# Altium schematic sheet FPGAIO.SCHDOC
size B
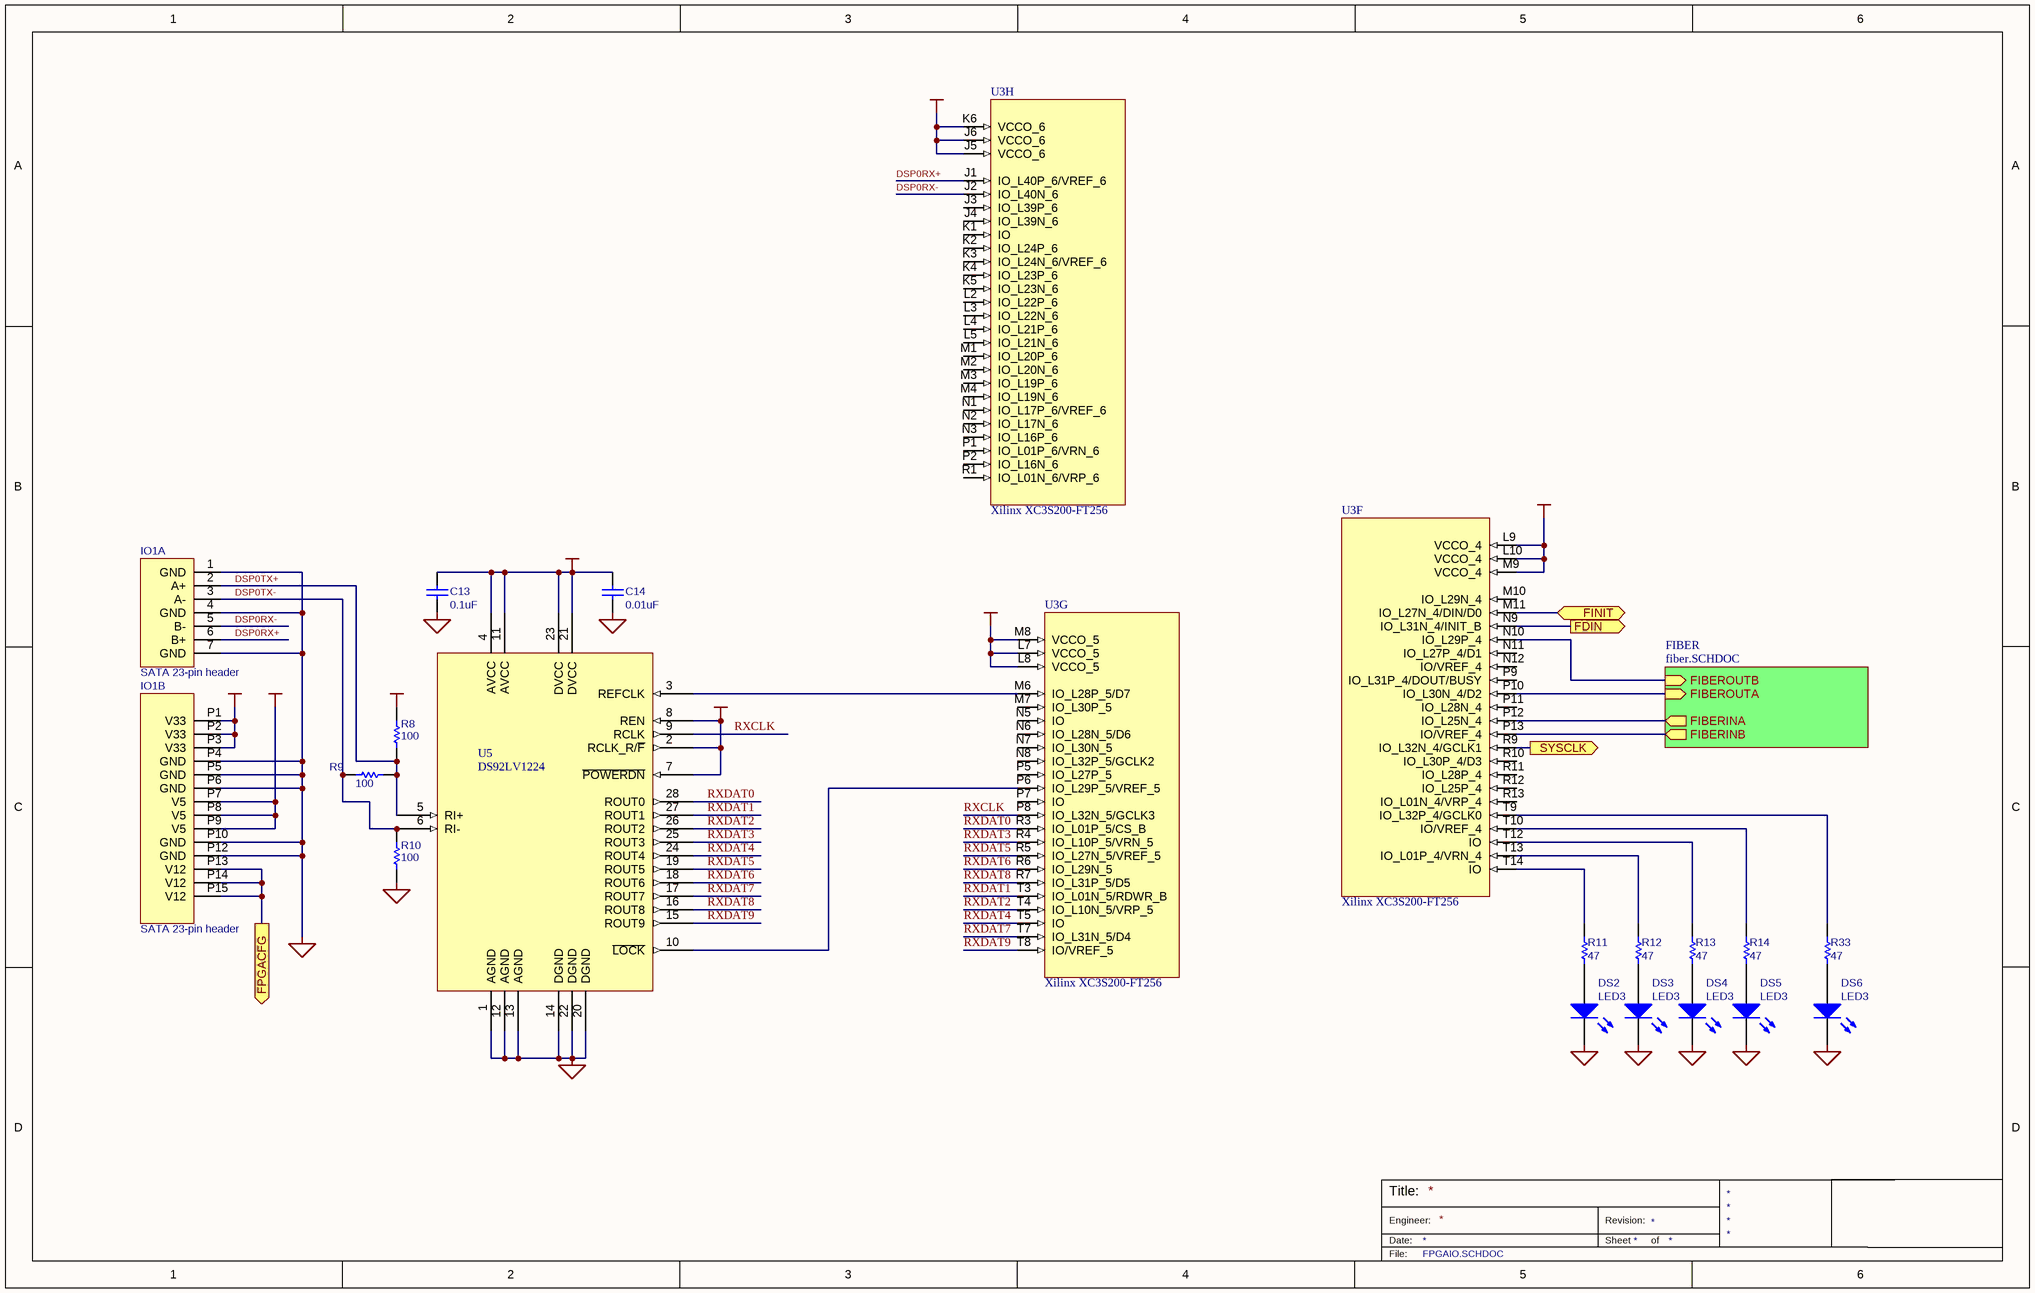
[diagram p0: FPGAIO.SCHDOC]

## Parts
C13  value 0.1uF  [CC1005-0402]  (hidden comment: Cap)
C14  value 0.01uF  [CC1005-0402]  (hidden comment: Cap)
DS2  LED3  [SMD _LED]
DS3  LED3  [SMD _LED]
DS4  LED3  [SMD _LED]
DS5  LED3  [SMD _LED]
DS6  LED3  [SMD _LED]
IO1  SATA 23-pin header  [MOLEX 87703-0001]  (parts A,B of 2)
R8  100  [CR1005-0402]
R9  100  [CR1005-0402]
R10  100  [CR1005-0402]
R11  value 47  [CR1608-0603]  (hidden comment: Res1)
R12  value 47  [CR1608-0603]  (hidden comment: Res1)
R13  value 47  [CR1608-0603]  (hidden comment: Res1)
R14  value 47  [CR1608-0603]  (hidden comment: Res1)
R33  value 47  [CR1608-0603]  (hidden comment: Res1)
U3  Xilinx XC3S200-FT256  [Xilinx FT256 BGA]  (parts F,G,H of 9)
U5  DS92LV1224  [SSO-G28/E4.3]

## Sub-sheets
FIBER = fiber.SCHDOC: FIBERINA (out), FIBEROUTB (in), FIBERINB (out), FIBEROUTA (in)

## Ports
FDIN (out), FINIT (bidir), FPGACFG (out), SYSCLK (out)

## Nets
+2.5VCC: U3.J5(VCCO_6) U3.J6(VCCO_6) U3.K6(VCCO_6)
+5VCC: IO1.P7(V5) IO1.P8(V5) IO1.P9(V5)
GND: C13.1 C14.1 DS2.2(K) DS3.2(K) DS4.2(K) DS5.2(K) DS6.2(K) IO1.1(GND) IO1.4(GND) IO1.7(GND) IO1.P4(GND) IO1.P5(GND) IO1.P6(GND) IO1.P10(GND) IO1.P12(GND) R10.1 U5.1(AGND) U5.12(AGND) U5.13(AGND) U5.14(DGND) U5.20(DGND) U5.22(DGND)
VCC: C13.2 C14.2 IO1.P1(V33) IO1.P2(V33) IO1.P3(V33) R8.1 U3.L7(VCCO_5) U3.L8(VCCO_5) U3.L9(VCCO_4) U3.L10(VCCO_4) U3.M8(VCCO_5) U3.M9(VCCO_4) U5.2(RCLK_R/~{F}) U5.4(AVCC) U5.7(~{POWERDN}) U5.8(REN) U5.11(AVCC) U5.21(DVCC) U5.23(DVCC)
DSP0RX+: IO1.6(B+) U3.J1(IO_L40P_6/VREF_6)
DSP0RX-: IO1.5(B-) U3.J2(IO_L40N_6)
DSP0TX+: IO1.2(A+) R8.2 R9.2 U5.5(RI+)
DSP0TX-: IO1.3(A-) R9.1 R10.2 U5.6(RI-)
FDIN: U3.N9(IO_L31N_4/INIT_B) ; port FDIN
FINIT: U3.M11(IO_L27N_4/DIN/D0) ; port FINIT
FPGACFG: IO1.P13(V12) IO1.P14(V12) IO1.P15(V12) ; port FPGACFG
RXCLK: U3.P8(IO_L32N_5/GCLK3) U5.9(RCLK)
RXDAT0: U3.R3(IO_L01P_5/CS_B) U5.28(ROUT0)
RXDAT1: U3.T3(IO_L01N_5/RDWR_B) U5.27(ROUT1)
RXDAT2: U3.T4(IO_L10N_5/VRP_5) U5.26(ROUT2)
RXDAT3: U3.R4(IO_L10P_5/VRN_5) U5.25(ROUT3)
RXDAT4: U3.T5(IO) U5.24(ROUT4)
RXDAT5: U3.R5(IO_L27N_5/VREF_5) U5.19(ROUT5)
RXDAT6: U3.R6(IO_L29N_5) U5.18(ROUT6)
RXDAT7: U3.T7(IO_L31N_5/D4) U5.17(ROUT7)
RXDAT8: U3.R7(IO_L31P_5/D5) U5.16(ROUT8)
RXDAT9: U3.T8(IO/VREF_5) U5.15(ROUT9)
SYSCLK: U3.R9(IO_L32N_4/GCLK1) ; port SYSCLK
NetDS2_1: DS2.1(A) R11.2
NetDS3_1: DS3.1(A) R12.2
NetDS4_1: DS4.1(A) R13.2
NetDS5_1: DS5.1(A) R14.2
NetDS6_1: DS6.1(A) R33.2
NetR11_1: R11.1 U3.T14(IO)
NetR12_1: R12.1 U3.T13(IO_L01P_4/VRN_4)
NetR13_1: R13.1 U3.T12(IO)
NetR14_1: R14.1 U3.T10(IO/VREF_4)
NetR33_1: R33.1 U3.T9(IO_L32P_4/GCLK0)
NetU3_M6: U3.M6(IO_L28P_5/D7) U5.3(REFCLK)
NetU3_N10: U3.N10(IO_L29P_4) ; sheet FIBER/FIBEROUTB
NetU3_P6: U3.P6(IO_L29P_5/VREF_5) U5.10(~{LOCK})
NetU3_P10: U3.P10(IO_L30N_4/D2) ; sheet FIBER/FIBEROUTA
NetU3_P12: U3.P12(IO_L25N_4) ; sheet FIBER/FIBERINA
NetU3_P13: U3.P13(IO/VREF_4) ; sheet FIBER/FIBERINB

Not connected (* = marked no-connect by the designer): U3 J3(IO_L39P_6) J4(IO_L39N_6) K1(IO) K2(IO_L24P_6) K3(IO_L24N_6/VREF_6) K4(IO_L23P_6) K5(IO_L23N_6) L2(IO_L22P_6) L3(IO_L22N_6) L4(IO_L21P_6) L5(IO_L21N_6) M1(IO_L20P_6) M2(IO_L20N_6) M3(IO_L19P_6) M4(IO_L19N_6) M7(IO_L30P_5) M10(IO_L29N_4) N1(IO_L17P_6/VREF_6) N2(IO_L17N_6) N3(IO_L16P_6) N5(IO) N6(IO_L28N_5/D6) N7(IO_L30N_5) N8(IO_L32P_5/GCLK2) N11(IO_L27P_4/D1) N12(IO/VREF_4) P1(IO_L01P_6/VRN_6) P2(IO_L16N_6) P5(IO_L27P_5) P7(IO) P9(IO_L31P_4/DOUT/BUSY) P11(IO_L28N_4) R1(IO_L01N_6/VRP_6) R10(IO_L30P_4/D3) R11(IO_L28P_4) R12(IO_L25P_4) R13(IO_L01N_4/VRP_4)

## Notes on the sheet
- Title:
- Engineer:
- Date:
- Revision:
- Sheet
- of
- File:

## Library data of the parts
C13 C14 = Cap: Capacitor; Manufacturer: Generic Components; Class I: Passive; Published: 8-Jun-2000; Revision: July-2002: Re-released for DXP Platform.; Publisher: Altium Limited; Class II: Capacitor
DS2-DS6 = LED3: Typical BLUE SiC LED; Published: 8-Jun-2000; LatestRevisionDate: 17-Dec-2003; LatestRevisionNote: PCB Footprint replaced.; Publisher: Altium Limited
IO1 = SATA-23
R8-R10 = Res1: Resistor; Manufacturer: Generic Components; Class I: Passive; Value: TERMVALUE; Published: 8-Jun-2000; Revision: July-2002: Re-released for DXP Platform.; Publisher: Altium Limited; Class II: Resistor
R11-R14 R33 = Res1: Resistor; Manufacturer: Generic Components; Class I: Passive; Published: 8-Jun-2000; Revision: July-2002: Re-released for DXP Platform.; Publisher: Altium Limited; Class II: Resistor
U3 = XC3S200-FT256: Xilinx Spartan-3 FPGA
U5 = DS92LV1224: 30-66 MHz 10-Bit Bus LVDS Deserializer